# Altium schematic sheet Drone1_V1 SCHEMATIC.SchDoc
size A4; DocumentNumber: 3; SheetNumber: 3; SheetTotal: 5; PageSetup: Record=PageOptions|CenterHorizontal=True|CenterVertical=True|PrintScale=0.73|XCorrection=1.00|YCorrection=1.00|PrintKind=0|BorderSize=5000000|LeftOffset=0|BottomOffset=0|Orientation=2|PaperLength=1000|PaperWidth=1000|Scale=100|PaperSource=7|PrintQuality=-3|MediaType=1|DitherType=10|PrintScaleMode=1|PaperKind=A3|PaperIndex=8
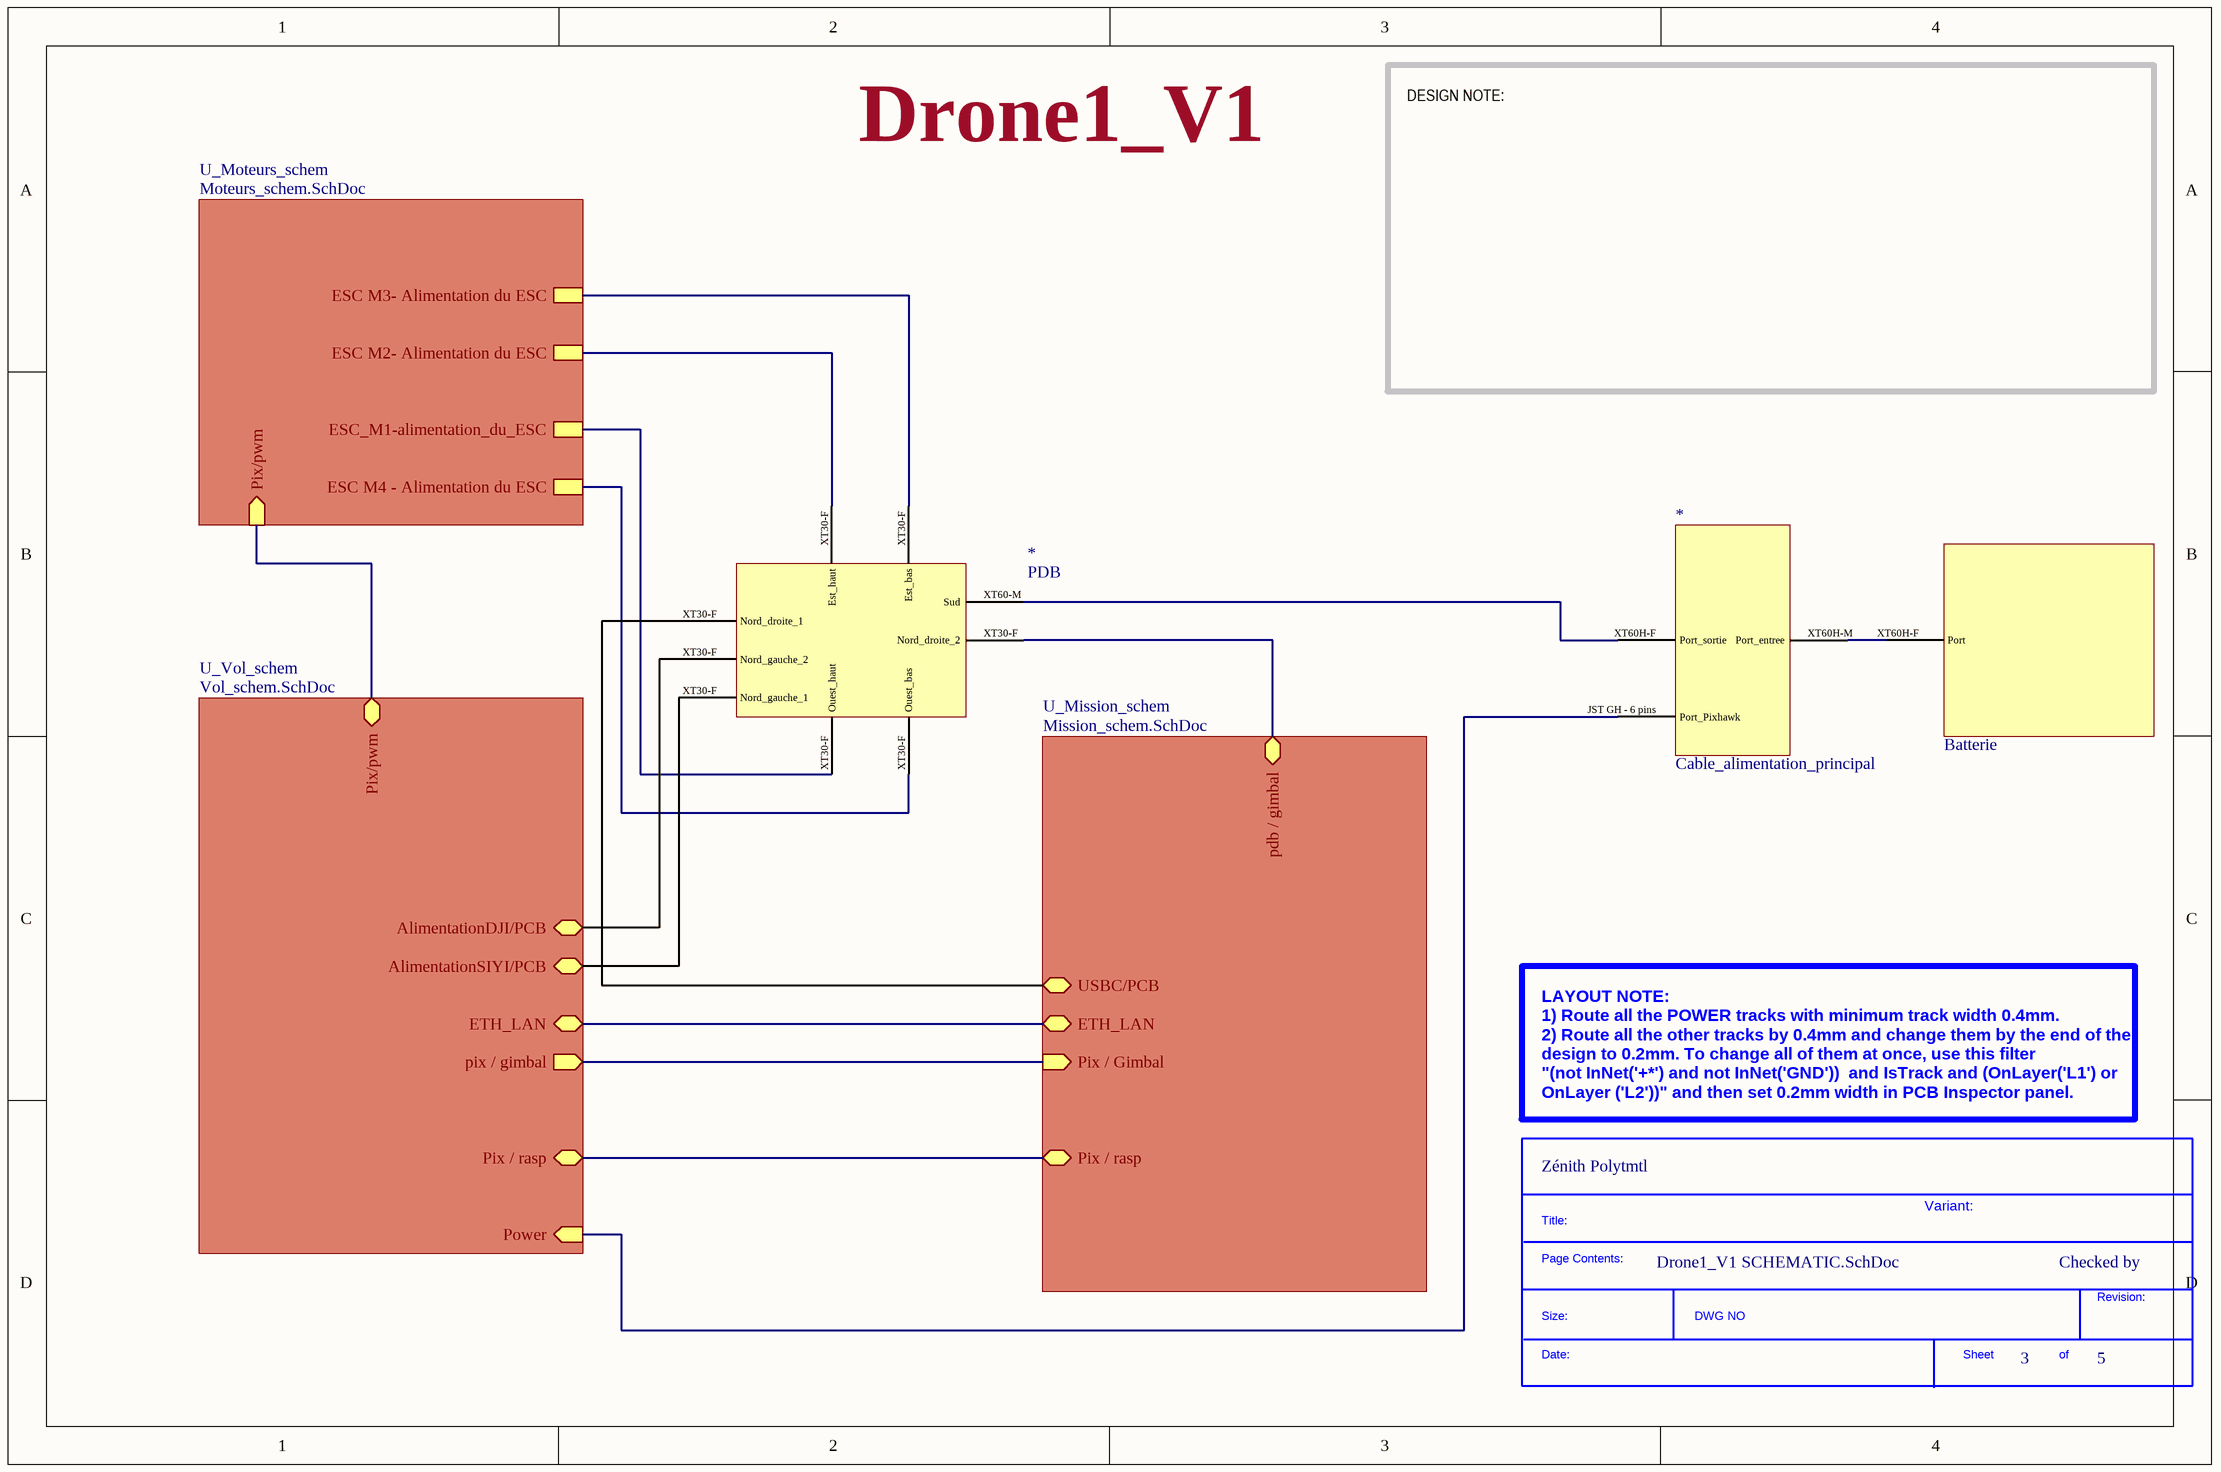
[diagram p0: Drone1_V1 SCHEMATIC.SchDoc]

## Parts
(Parts that share a designator on the sheet are numbered #1, #2 ... from top to bottom, then left to right.)
*#1  Cable_alimentation_principal
*#2  PDB
*#3  SDTitleBlock  (value not drawn)  (graphical)
?  Batterie

## Sub-sheets
U_Mission_schem = Mission_schem.SchDoc: ETH_LAN (bidir), Pix / Gimbal (in), Pix / rasp (bidir), pdb / gimbal (bidir), USBC/PCB (bidir)
U_Moteurs_schem = Moteurs_schem.SchDoc: ESC M3- Alimentation du ESC, ESC_M1-alimentation_du_ESC, ESC M4 - Alimentation du ESC, ESC M2- Alimentation du ESC, Pix/pwm (in)
U_Vol_schem = Vol_schem.SchDoc: ETH_LAN (bidir), Power (in), pix / gimbal (out), Pix / rasp (bidir), Pix/pwm (bidir), AlimentationSIYI/PCB (bidir), AlimentationDJI/PCB (bidir)

## Nets
Net*#1_JST GH - 6 pins: *#1.JST_GH_-_6_pins(Port_Pixhawk) ; sheet U_Vol_schem/Power
Net*#1_XT60H-F: *#1.XT60H-F(Port_sortie) *#2.XT60-M(Sud)
Net*#1_XT60H-M: *#1.XT60H-M(Port_entree) ?.XT60H-F(Port)
Net*#2_XT30-F: *#2.XT30-F(Est_haut) ; sheet U_Moteurs_schem/ESC M2- Alimentation du ESC
Net*#2_XT30-F: *#2.XT30-F(Est_bas) ; sheet U_Moteurs_schem/ESC M3- Alimentation du ESC  [a separate net that carries the same name]
Net*#2_XT30-F: *#2.XT30-F(Ouest_haut) ; sheet U_Moteurs_schem/ESC_M1-alimentation_du_ESC  [a separate net that carries the same name]
Net*#2_XT30-F: *#2.XT30-F(Ouest_bas) ; sheet U_Moteurs_schem/ESC M4 - Alimentation du ESC  [a separate net that carries the same name]
Net*#2_XT30-F: *#2.XT30-F(Nord_droite_2) ; sheet U_Mission_schem/pdb / gimbal  [a separate net that carries the same name]
(unnamed): sheet U_Moteurs_schem/Pix/pwm, sheet U_Vol_schem/Pix/pwm
(unnamed): sheet U_Mission_schem/ETH_LAN, sheet U_Vol_schem/ETH_LAN
(unnamed): sheet U_Mission_schem/Pix / Gimbal, sheet U_Vol_schem/pix / gimbal
(unnamed): sheet U_Mission_schem/Pix / rasp, sheet U_Vol_schem/Pix / rasp

## Notes on the sheet
- Drone1_V1
- DESIGN NOTE:
- (near *#3) Zénith Polytmtl
- (near *#3) LAYOUT NOTE:
  1) Route all the POWER tracks with minimum track width 0.4mm.
  2) Route all the other tracks by 0.4mm and change them by the end of the design to 0.2mm. To change all of them at once, use this filter
  "(not InNet('+*') and not InNet('GND'))  and IsTrack and (OnLayer('L1') or OnLayer ('L2'))" and then set 0.2mm width in PCB Inspector panel.
- Variant:
- Checked by
- (in symbol SDTitleBlock) Title:; Page Contents:; Revision:; Size:; DWG NO; Date:; Sheet; of